# Altium schematic sheet ADD-ON.SchDoc
size A4
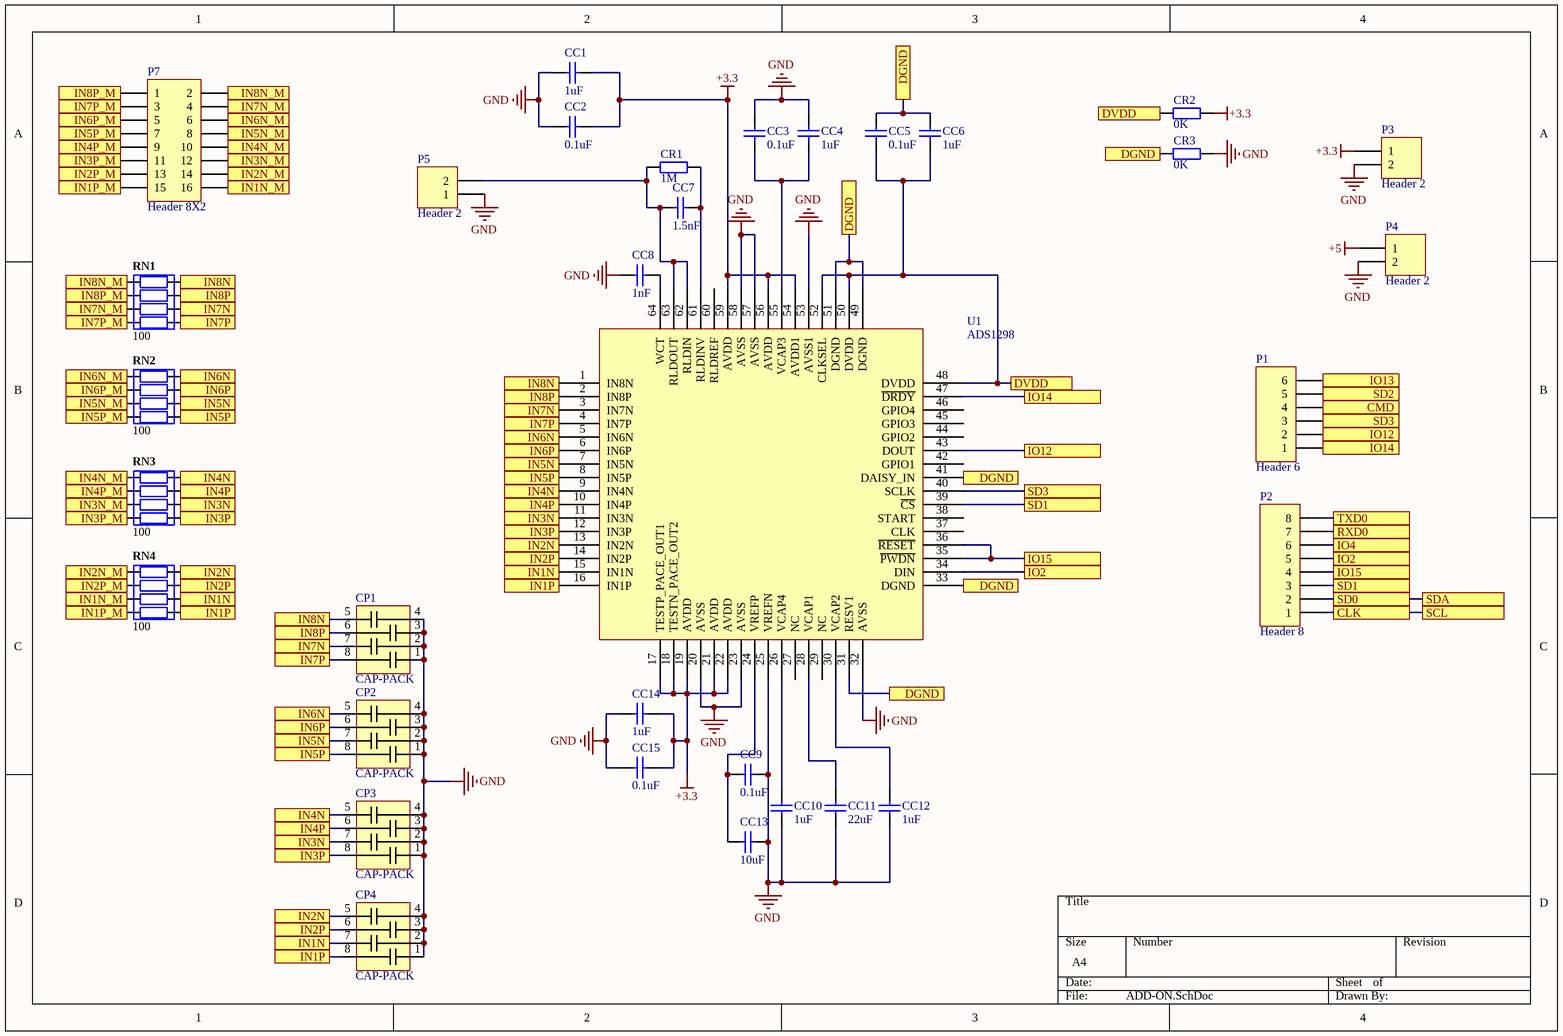
[diagram p0: ADD-ON.SchDoc]

## Parts
CC1  value 1uF  [CC1005-0402]  (hidden comment: Cap Chip 0402)
CC2  value 0.1uF  [CC1005-0402]  (hidden comment: Cap Chip 0402)
CC3  value 0.1uF  [CC1005-0402]  (hidden comment: Cap Chip 0402)
CC4  value 1uF  [CC1005-0402]  (hidden comment: Cap Chip 0402)
CC5  value 0.1uF  [CC1005-0402]  (hidden comment: Cap Chip 0402)
CC6  value 1uF  [CC1005-0402]  (hidden comment: Cap Chip 0402)
CC7  value 1.5nF  [CC1005-0402]  (hidden comment: Cap Chip 0402)
CC8  value 1nF  [CC1005-0402]  (hidden comment: Cap Chip 0402)
CC9  value 0.1uF  [CC1005-0402]  (hidden comment: Cap Chip 0402)
CC10  value 1uF  [CC1005-0402]  (hidden comment: Cap Chip 0402)
CC11  value 22uF  [CC1608-0603]  (hidden comment: Cap Chip 0603)
CC12  value 1uF  [CC1005-0402]  (hidden comment: Cap Chip 0402)
CC13  value 10uF  [CC1608-0603]  (hidden comment: Cap Chip 0603)
CC14  value 1uF  [CC1005-0402]  (hidden comment: Cap Chip 0402)
CC15  value 0.1uF  [CC1005-0402]  (hidden comment: Cap Chip 0402)
CP1  CAP-PACK  [CAP-PACK-4]
CP2  CAP-PACK  [CAP-PACK-4]
CP3  CAP-PACK  [CAP-PACK-4]
CP4  CAP-PACK  [CAP-PACK-4]
CR1  value 1M  [CR1005-0402]  (hidden comment: Resistor Chip 0402)
CR2  value 0K  [CR1005-0402]  (hidden comment: Resistor Chip 0402)
CR3  value 0K  [CR1005-0402]  (hidden comment: Resistor Chip 0402)
P1  Header 6  [HDR1X6]
P2  Header 8  [HDR1X8]
P3  Header 2  [HDR1X2]
P4  Header 2  [HDR1X2]
P5  Header 2  [HDR1X2]
P7  Header 8X2  [HDR2X8]
RN1  Resistance: 100  [RESNET-1005X4]  (hidden comment: RESNET 4 x 100R)
RN2  Resistance: 100  [RESNET-1005X4]  (hidden comment: RESNET 4 x 100R)
RN3  Resistance: 100  [RESNET-1005X4]  (hidden comment: RESNET 4 x 100R)
RN4  Resistance: 100  [RESNET-1005X4]  (hidden comment: RESNET 4 x 100R)
U1  ADS1298  [ADS1298]

## Ports
CLK, CMD, DGND, DVDD, IN1N, IN1N_M, IN1P, IN1P_M, IN2N, IN2N_M, IN2P, IN2P_M, IN3N, IN3N_M, IN3P, IN3P_M, IN4N, IN4N_M, IN4P, IN4P_M, IN5N, IN5N_M, IN5P, IN5P_M, IN6N, IN6N_M, IN6P, IN6P_M, IN7N, IN7N_M, IN7P, IN7P_M, IN8N, IN8N_M, IN8P, IN8P_M, IO2, IO4, IO12, IO13, IO14, IO15, RXD0, SCL, SD0, SD1, SD2, SD3, SDA, TXD0

## Nets
+3.3: CC1.1 CC2.1 CC14.1 CC15.1 CR2.2 P3.1 U1.17(TESTP_PACE_OUT1) U1.18(TESTN_PACE_OUT2) U1.19(AVDD) U1.21(AVDD) U1.22(AVDD) U1.54(AVDD1) U1.56(AVDD) U1.59(AVDD)
+5: P4.1
GND: CC1.2 CC2.2 CC3.2 CC4.2 CC8.2 CC9.2 CC10.1 CC11.1 CC12.1 CC13.2 CC14.2 CC15.2 CP1.1 CP1.2 CP1.3 CP1.4 CP2.1 CP2.2 CP2.3 CP2.4 CP3.1 CP3.2 CP3.3 CP3.4 CP4.1 CP4.2 CP4.3 CP4.4 CR3.2 P3.2 P4.2 P5.1 U1.20(AVSS) U1.23(AVSS) U1.25(VREFN) U1.32(AVSS) U1.53(AVSS1) U1.57(AVSS) U1.58(AVSS)
CLK: P2.1 ; port CLK, port SCL
CMD: P1.4 ; port CMD
DGND: CC5.2 CC6.2 CR3.1 U1.31(RESV1) U1.33(DGND) U1.41(DAISY_IN) U1.49(DGND) U1.51(DGND) ; port DGND
DVDD: CC5.1 CC6.1 CR2.1 U1.48(DVDD) U1.50(DVDD) U1.52(CLKSEL) ; port DVDD
IN1N: CP4.7 RN4.6 U1.15(IN1N) ; port IN1N
IN1N_M: P7.16 RN4.3 ; port IN1N_M
IN1P: CP4.8 RN4.5 U1.16(IN1P) ; port IN1P
IN1P_M: P7.15 RN4.4 ; port IN1P_M
IN2N: CP4.5 RN4.8 U1.13(IN2N) ; port IN2N
IN2N_M: P7.14 RN4.1 ; port IN2N_M
IN2P: CP4.6 RN4.7 U1.14(IN2P) ; port IN2P
IN2P_M: P7.13 RN4.2 ; port IN2P_M
IN3N: CP3.7 RN3.6 U1.11(IN3N) ; port IN3N
IN3N_M: P7.12 RN3.3 ; port IN3N_M
IN3P: CP3.8 RN3.5 U1.12(IN3P) ; port IN3P
IN3P_M: P7.11 RN3.4 ; port IN3P_M
IN4N: CP3.5 RN3.8 U1.9(IN4N) ; port IN4N
IN4N_M: P7.10 RN3.1 ; port IN4N_M
IN4P: CP3.6 RN3.7 U1.10(IN4P) ; port IN4P
IN4P_M: P7.9 RN3.2 ; port IN4P_M
IN5N: CP2.7 RN2.6 U1.7(IN5N) ; port IN5N
IN5N_M: P7.8 RN2.3 ; port IN5N_M
IN5P: CP2.8 RN2.5 U1.8(IN5P) ; port IN5P
IN5P_M: P7.7 RN2.4 ; port IN5P_M
IN6N: CP2.5 RN2.8 U1.5(IN6N) ; port IN6N
IN6N_M: P7.6 RN2.1 ; port IN6N_M
IN6P: CP2.6 RN2.7 U1.6(IN6P) ; port IN6P
IN6P_M: P7.5 RN2.2 ; port IN6P_M
IN7N: CP1.7 RN1.6 U1.3(IN7N) ; port IN7N
IN7N_M: P7.4 RN1.3 ; port IN7N_M
IN7P: CP1.8 RN1.5 U1.4(IN7P) ; port IN7P
IN7P_M: P7.3 RN1.4 ; port IN7P_M
IN8N: CP1.5 RN1.8 U1.1(IN8N) ; port IN8N
IN8N_M: P7.2 RN1.1 ; port IN8N_M
IN8P: CP1.6 RN1.7 U1.2(IN8P) ; port IN8P
IN8P_M: P7.1 RN1.2 ; port IN8P_M
IO2: P2.5 U1.34(DIN) ; port IO2
IO4: P2.6 ; port IO4
IO12: P1.2 U1.43(DOUT) ; port IO12
IO13: P1.6 ; port IO13
IO14: P1.1 U1.47(~{DRDY}) ; port IO14
IO15: P2.4 U1.35(~{PWDN}) U1.36(~{RESET}) ; port IO15
RXD0: P2.7 ; port RXD0
SD0: P2.2 ; port SD0, port SDA
SD1: P2.3 U1.39(~{CS}) ; port SD1
SD2: P1.5 ; port SD2
SD3: P1.3 U1.40(SCLK) ; port SD3
TXD0: P2.8 ; port TXD0
NetCC3_1: CC3.1 CC4.1 U1.55(VCAP3)
NetCC7_1: CC7.1 CR1.1 P5.2 U1.62(RLDIN) U1.63(RLDOUT)
NetCC7_2: CC7.2 CR1.2 U1.61(RLDINV)
NetCC8_1: CC8.1 U1.64(WCT)
NetCC9_1: CC9.1 CC13.1 U1.24(VREFP)
NetCC10_2: CC10.2 U1.26(VCAP4)
NetCC11_2: CC11.2 U1.28(VCAP1)
NetCC12_2: CC12.2 U1.30(VCAP2)

Not connected (* = marked no-connect by the designer): U1 27(NC) 29(NC) 37(CLK) 38(START) 42(GPIO1) 44(GPIO2) 45(GPIO3) 46(GPIO4) 60(RLDREF)

## Library data of the parts
CC1-CC10 CC12 CC14 CC15 = Cap Chip 0402: Polarized Capacitor (Radial); Published: 8-Jun-2000; Revision: July-2002: Re-released for DXP Platform.; Publisher: Altium Limited
CC11 CC13 = Cap Chip 0603: Polarized Capacitor (Radial); Published: 8-Jun-2000; Revision: July-2002: Re-released for DXP Platform.; Publisher: Altium Limited
CR1-CR3 = Resistor Chip 0402: Resistor; Published: 8-Jun-2000; Revision: July-2002: Re-released for DXP Platform.; Publisher: Altium Limited
P1 = Header 6: Header, 6-Pin; LatestRevisionDate: 17-Jul-2002; LatestRevisionNote: Re-released for DXP Platform.; Publisher: Altium Limited
P2 = Header 8: Header, 8-Pin; LatestRevisionDate: 17-Jul-2002; LatestRevisionNote: Re-released for DXP Platform.; Publisher: Altium Limited
P3-P5 = Header 2: Header, 2-Pin; LatestRevisionDate: 17-Jul-2002; LatestRevisionNote: Re-released for DXP Platform.; Publisher: Altium Limited
P7 = Header 8X2: Header, 8-Pin, Dual row; LatestRevisionDate: 17-Jul-2002; LatestRevisionNote: Re-released for DXP Platform.; Publisher: Altium Limited
RN1-RN4 = Res Pack SMT4: Resistor Network, Isolated, 4 x 100R, 5%, SMD 0402 x 4; Power Rating: 63 mW; Mounting Technology: Surface Mount; Status: Unreleased; Tolerance: 5 %; Category: Resistor-Network